# Altium schematic sheet gitarukuranjadi.SCHDOC
size A
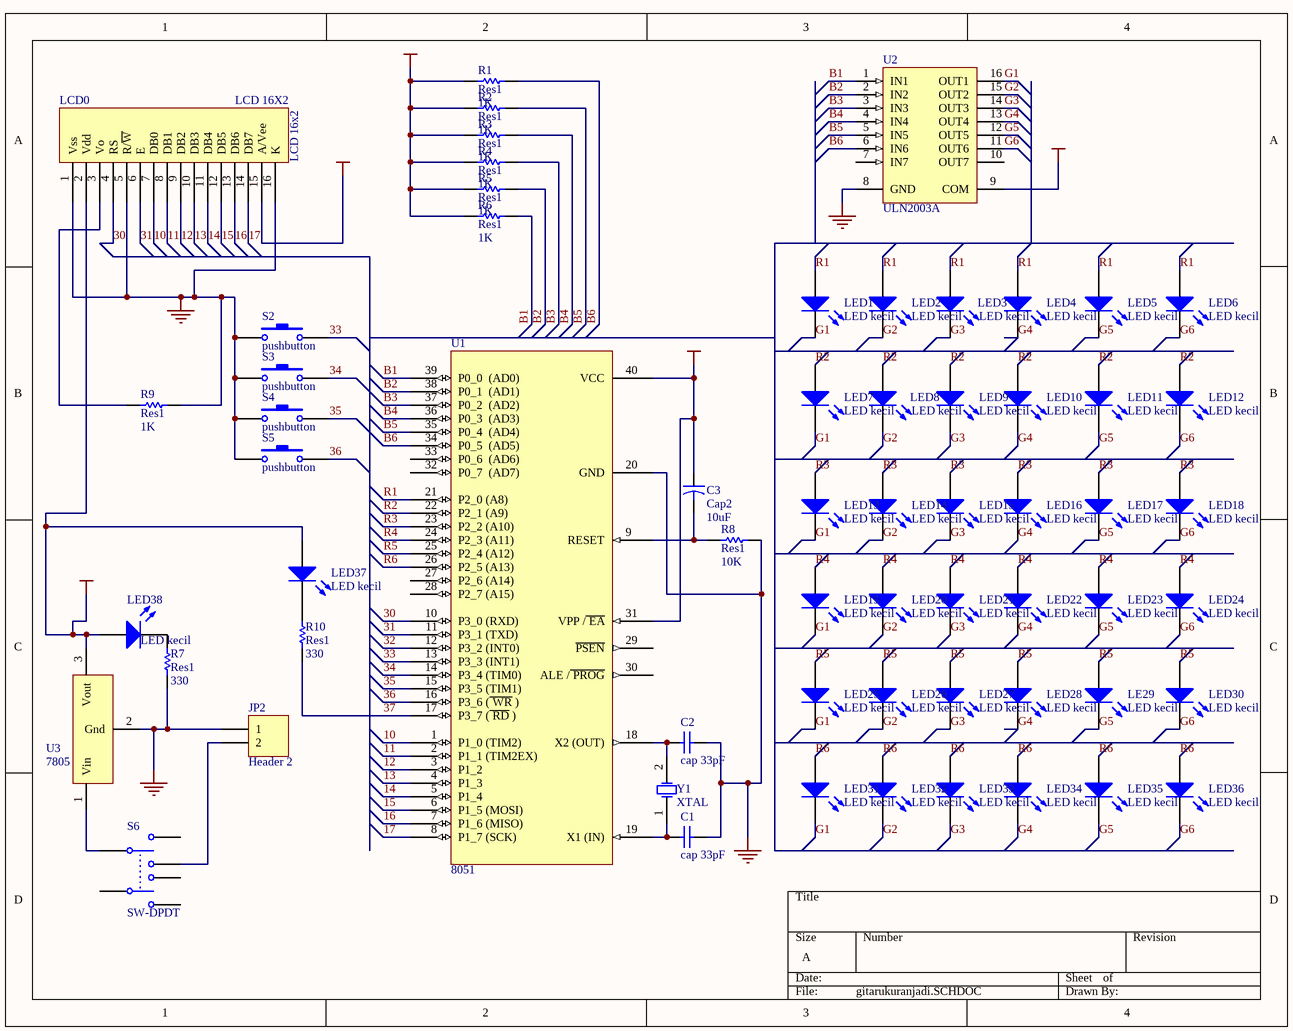
[diagram p0: gitarukuranjadi.SCHDOC]

## Parts
C1  cap 33pF  [cap 22/33uF]
C2  cap 33pF  [cap 22/33uF]
C3  Cap2  value 10uF  [CAPR5-4X5]
JP2  Header 2  [HDR1X2]
LCD0  LCD 16X2  [LCD 16X2]
LE29  LED kecil  [LED kecil]
LED1  LED kecil  [LED kecil]
LED2  LED kecil  [LED kecil]
LED3  LED kecil  [LED kecil]
LED4  LED kecil  [LED kecil]
LED5  LED kecil  [LED kecil]
LED6  LED kecil  [LED kecil]
LED7  LED kecil  [LED kecil]
LED8  LED kecil  [LED kecil]
LED9  LED kecil  [LED kecil]
LED10  LED kecil  [LED kecil]
LED11  LED kecil  [LED kecil]
LED12  LED kecil  [LED kecil]
LED13  LED kecil  [LED kecil]
LED14  LED kecil  [LED kecil]
LED15  LED kecil  [LED kecil]
LED16  LED kecil  [LED kecil]
LED17  LED kecil  [LED kecil]
LED18  LED kecil  [LED kecil]
LED19  LED kecil  [LED kecil]
LED20  LED kecil  [LED kecil]
LED21  LED kecil  [LED kecil]
LED22  LED kecil  [LED kecil]
LED23  LED kecil  [LED kecil]
LED24  LED kecil  [LED kecil]
LED25  LED kecil  [LED kecil]
LED26  LED kecil  [LED kecil]
LED27  LED kecil  [LED kecil]
LED28  LED kecil  [LED kecil]
LED30  LED kecil  [LED kecil]
LED31  LED kecil  [LED kecil]
LED32  LED kecil  [LED kecil]
LED33  LED kecil  [LED kecil]
LED34  LED kecil  [LED kecil]
LED35  LED kecil  [LED kecil]
LED36  LED kecil  [LED kecil]
LED37  LED kecil  [LED kecil]
LED38  LED kecil  [LED kecil]
R1  Res1  value 1K  [AXIAL-0.3]
R2  Res1  value 1K  [AXIAL-0.3]
R3  Res1  value 1K  [AXIAL-0.3]
R4  Res1  value 1K  [AXIAL-0.3]
R5  Res1  value 1K  [AXIAL-0.3]
R6  Res1  value 1K  [AXIAL-0.3]
R7  Res1  value 330  [AXIAL-0.3]
R8  Res1  value 10K  [AXIAL-0.3]
R9  Res1  value 1K  [AXIAL-0.3]
R10  Res1  value 330  [AXIAL-0.3]
S2  pushbutton  [pushbutton]
S3  pushbutton  [pushbutton]
S4  pushbutton  [pushbutton]
S5  pushbutton  [pushbutton]
S6  SW-DPDT  [DPDT-6]
U1  8051  [8051 40 pin]
U2  ULN2003A  [A16]
U3  7805  [78XX/79XX]
Y1  XTAL  [XTAL]

## Nets
GND: C1.2 C2.2 JP2.1 LCD0.1(Vss) LCD0.5(R/~{W}) LCD0.16(K) R7.1 R8.2 R9.2 S2.1 S3.1 S4.1 S5.1 U1.20(GND) U2.8(GND) U3.2(Gnd)
VCC: C3.1 LCD0.2(Vdd) LCD0.15(A/Vee) LED37.1(A) LED38.1(A) R1.1 R2.1 R3.1 R4.1 R5.1 R6.1 U1.31(VPP_/~{_EA}) U1.40(VCC) U2.9(COM) U3.3(Vout)
10: LCD0.7(DB0) U1.1(P1_0_(TIM2))
11: LCD0.8(DB1) U1.2(P1_1_(TIM2EX))
12: LCD0.9(DB2) U1.3(P1_2)
13: LCD0.10(DB3) U1.4(P1_3)
14: LCD0.11(DB4) U1.5(P1_4)
15: LCD0.12(DB5) U1.6(P1_5_(MOSI))
16: LCD0.13(DB6) U1.7(P1_6_(MISO))
17: LCD0.14(DB7) U1.8(P1_7_(SCK))
30: LCD0.4(RS) U1.10(P3_0_(RXD))
31: LCD0.6(E) U1.11(P3_1_(TXD))
32: U1.12(P3_2_(INT0))
33: S2.2 U1.13(P3_3_(INT1))
34: S3.2 U1.14(P3_4_(TIM0))
35: S4.2 U1.15(P3_5_(TIM1))
36: S5.2 U1.16(P3_6_(~{_WR}_))
37: R10.1 U1.17(P3_7_(~{_RD}_))
B1: R6.2 U1.39(P0_0__(AD0)) U2.1(IN1)
B2: R5.2 U1.38(P0_1__(AD1)) U2.2(IN2)
B3: R4.2 U1.37(P0_2__(AD2)) U2.3(IN3)
B4: R3.2 U1.36(P0_3__(AD3)) U2.4(IN4)
B5: R2.2 U1.35(P0_4__(AD4)) U2.5(IN5)
B6: R1.2 U1.34(P0_5__(AD5)) U2.6(IN6)
G1: LED1.2(K) LED7.2(K) LED13.2(K) LED19.2(K) LED25.2(K) LED31.2(K) U2.16(OUT1)
G2: LED2.2(K) LED8.2(K) LED14.2(K) LED20.2(K) LED26.2(K) LED32.2(K) U2.15(OUT2)
G3: LED3.2(K) LED9.2(K) LED15.2(K) LED21.2(K) LED27.2(K) LED33.2(K) U2.14(OUT3)
G4: LED4.2(K) LED10.2(K) LED16.2(K) LED22.2(K) LED28.2(K) LED34.2(K) U2.13(OUT4)
G5: LE29.2(K) LED5.2(K) LED11.2(K) LED17.2(K) LED23.2(K) LED35.2(K) U2.12(OUT5)
G6: LED6.2(K) LED12.2(K) LED18.2(K) LED24.2(K) LED30.2(K) LED36.2(K) U2.11(OUT6)
R1: LED1.1(A) LED2.1(A) LED3.1(A) LED4.1(A) LED5.1(A) LED6.1(A) U1.21(P2_0_(A8))
R2: LED7.1(A) LED8.1(A) LED9.1(A) LED10.1(A) LED11.1(A) LED12.1(A) U1.22(P2_1_(A9))
R3: LED13.1(A) LED14.1(A) LED15.1(A) LED16.1(A) LED17.1(A) LED18.1(A) U1.23(P2_2_(A10))
R4: LED19.1(A) LED20.1(A) LED21.1(A) LED22.1(A) LED23.1(A) LED24.1(A) U1.24(P2_3_(A11))
R5: LE29.1(A) LED25.1(A) LED26.1(A) LED27.1(A) LED28.1(A) LED30.1(A) U1.25(P2_4_(A12))
R6: LED31.1(A) LED32.1(A) LED33.1(A) LED34.1(A) LED35.1(A) LED36.1(A) U1.26(P2_5_(A13))
NetC1_1: C1.1 U1.19(X1_(IN)) Y1.1(OSC1)
NetC2_1: C2.1 U1.18(X2_(OUT)) Y1.2(OSC2)
NetC3_2: C3.2 R8.1 U1.9(RESET)
NetJP2_2: JP2.2 S6.3
NetLCD0_3: LCD0.3(Vo) R9.1
NetLED37_2: LED37.2(K) R10.2
NetLED38_2: LED38.2(K) R7.2
NetS6_1: S6.1 U3.1(Vin)

Not connected (* = marked no-connect by the designer): S6 2 4 5 6; U1 27(P2_6_(A14)) 28(P2_7_(A15)) 29(~{PSEN}) 30(ALE_/~{_PROG}) 32(P0_7__(AD7)) 33(P0_6__(AD6)); U2 7(IN7) 10(OUT7)

## Notes on the sheet
- (in symbol LCD 16X2) LCD 16x2

## Library data of the parts
C1 C2 = cap 22/33uF
C3 = Cap2: Capacitor; Published: 23-Sep-2002; Publisher: Altium Limited
JP2 = Header 2: Header, 2-Pin; Revision: 17-Jul-2002: Re-released for DXP Platform.; Publisher: Altium Limited
R1-R10 = Res1: Resistor; Published: 8-Jun-2000; Revision: July-2002: Re-released for DXP Platform.; Publisher: Altium Limited
S6 = SW-DPDT: Double-Pole, Double-Throw Switch; Published: 24-Mar-1999; Revision: July-2002: Re-released for DXP Platform.; Publisher: Altium Limited
U1 = 8051 40 pin
U2 = ULN2003A: High-Voltage, High-Current Darlington Array; PackageDocument: 1998; Published: 13-Oct-2000; LatestRevisionDate: 06-Jun-2005; LatestRevisionNote: Stylized 3D Model Added.; DatasheetDocument: 1998; PackageReference: A16; Publisher: Altium Limited; Code_JEDEC: MS-001-BB; ComponentLink1Description: Manufacturer Link; ComponentLink1URL: http://www.allegromicro.com/
U3 = 7805/7809/7812/7905/7909/7912